# Altium schematic sheet Onion_Omega_Debug_PCB.SchDoc
size B
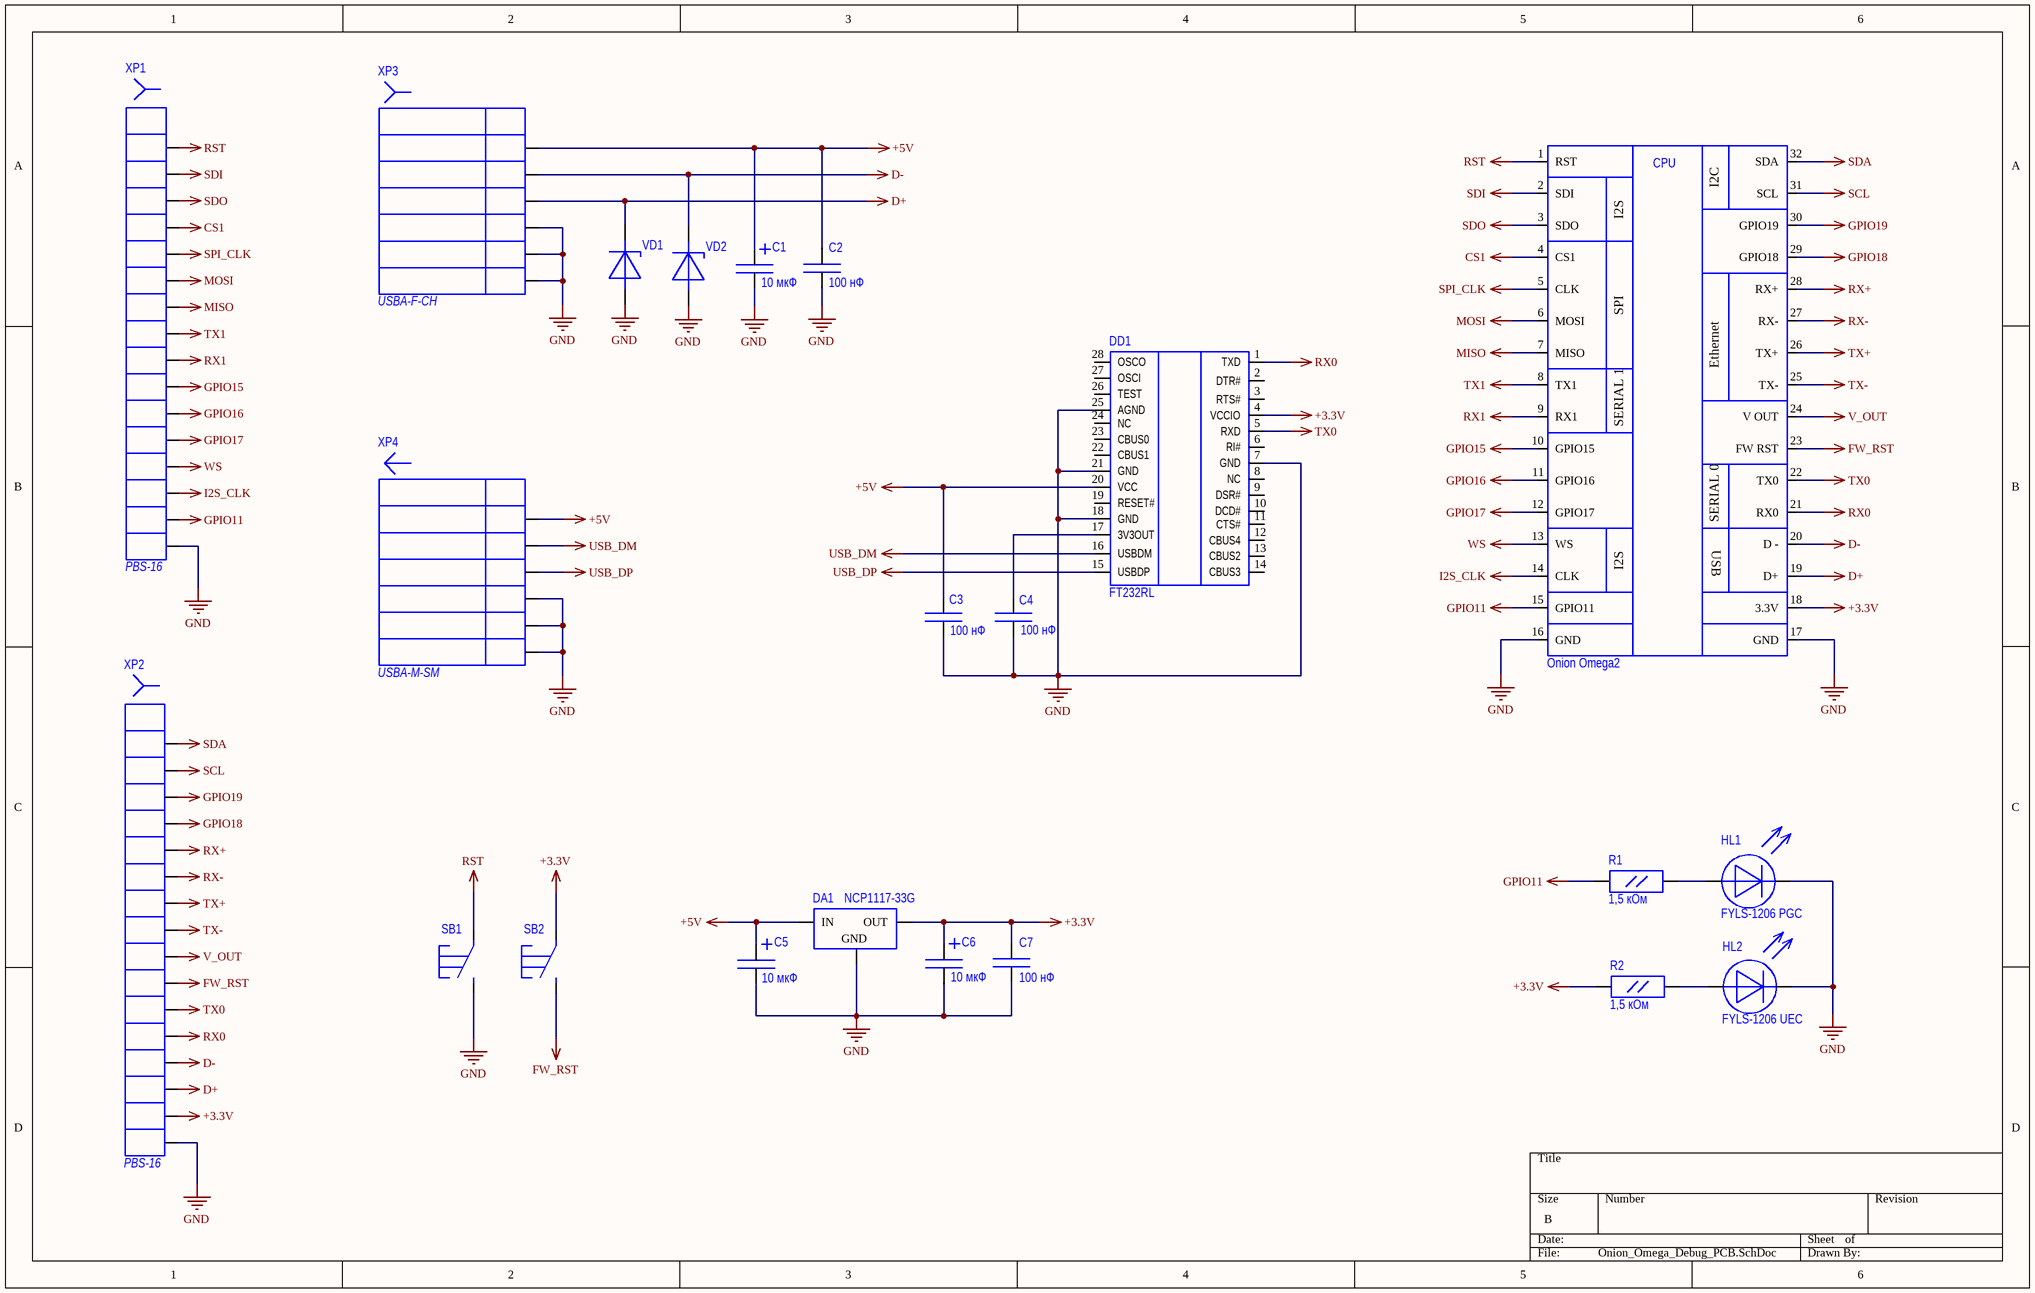
[diagram p0: Onion_Omega_Debug_PCB.SchDoc]

## Parts
C1  10 мкФ  [A-case]
C2  100 нФ  [CAP0805]
C3  100 нФ  [CAP0805]
C4  100 нФ  [CAP0805]
C5  10 мкФ  [A-case]
C6  10 мкФ  [A-case]
C7  100 нФ  [CAP0805]
DA1  NCP1117-33G  [D-PAK]
DD1  FT232RL  [SSOP-28]
HL1  FYLS-1206 PGC  [LED 1206 GREEN]
HL2  FYLS-1206 UЕC  [LED 1206 RED]
OMEGA2  Onion Omega2  [Onion_Omega2]
R1  1,5 кОм  [RES0805]
R2  1,5 кОм  [RES0805]
SB1  (no value)  [KLS7-TS6606]
SB2  (no value)  [KLS7-TS6606]
VD1  (no value)  [SOT-23]
VD2  (no value)  [SOT-23]
XP1  PBS-16  [PBS-16]
XP2  PBS-16  [PBS-16]
XP3  USBA-F-CH  [USBA-F-CH]
XP4  USBA-M-SM  [USBA-M-SM]

## Nets
+3.3V: C6.1 C7.1 DA1.2(OUT) DD1.4(VCCIO) OMEGA2.18(3.3V) R2.2 SB2.1 XP2.15
+5V: C1.1 C2.1 C3.1 C5.1 DA1.3(IN) DD1.20(VCC) XP3.1 XP4.1
CS1: OMEGA2.4(CS1) XP1.4
D+: OMEGA2.19(D+) VD1.3(C) XP2.14 XP3.3
D-: OMEGA2.20(D_-) VD2.3(C) XP2.13 XP3.2
FW_RST: OMEGA2.23(FW_RST) SB2.2 XP2.10
GND: C1.2 C2.2 C3.2 C4.1 C5.2 C6.2 C7.2 DA1.1(GND) DD1.7(GND) DD1.18(GND) DD1.21(GND) DD1.25(AGND) HL1.2(C) HL2.2(C) OMEGA2.16(GND) OMEGA2.17(GND) SB1.2 VD1.1(A) VD2.1(A) XP1.16 XP2.16 XP3.4 XP3.5 XP3.6 XP4.4 XP4.5 XP4.6
GPIO11: OMEGA2.15(GPIO11) R1.1 XP1.15
GPIO15: OMEGA2.10(GPIO15) XP1.10
GPIO16: OMEGA2.11(GPIO16) XP1.11
GPIO17: OMEGA2.12(GPIO17) XP1.12
GPIO18: OMEGA2.29(GPIO18) XP2.4
GPIO19: OMEGA2.30(GPIO19) XP2.3
I2S_CLK: OMEGA2.14(CLK) XP1.14
MISO: OMEGA2.7(MISO) XP1.7
MOSI: OMEGA2.6(MOSI) XP1.6
RST: OMEGA2.1(RST) SB1.1 XP1.1
RX0: DD1.1(TXD) OMEGA2.21(RX0) XP2.12
RX1: OMEGA2.9(RX1) XP1.9
RX+: OMEGA2.28(RX+) XP2.5
RX-: OMEGA2.27(RX-) XP2.6
SCL: OMEGA2.31(SCL) XP2.2
SDA: OMEGA2.32(SDA) XP2.1
SDI: OMEGA2.2(SDI) XP1.2
SDO: OMEGA2.3(SDO) XP1.3
SPI_CLK: OMEGA2.5(CLK) XP1.5
TX0: DD1.5(RXD) OMEGA2.22(TX0) XP2.11
TX1: OMEGA2.8(TX1) XP1.8
TX+: OMEGA2.26(TX+) XP2.7
TX-: OMEGA2.25(TX-) XP2.8
USB_DM: DD1.16(USBDM) XP4.2
USB_DP: DD1.15(USBDP) XP4.3
V_OUT: OMEGA2.24(V_OUT) XP2.9
WS: OMEGA2.13(WS) XP1.13
NetC4_2: C4.2 DD1.17(3V3OUT)
NetHL1_1: HL1.1(A) R1.2
NetHL2_1: HL2.1(A) R2.1

Not connected (* = marked no-connect by the designer): DD1 2(DTR#) 3(RTS#) 6(RI#) 8(NC) 9(DSR#) 10(DCD#) 11(CTS#) 12(CBUS4) 13(CBUS2) 14(CBUS3) 19(RESET#) 22(CBUS1) 23(CBUS0) 24(NC) 26(TEST) 27(OSCI) 28(OSCO)

## Notes on the sheet
- (in symbol D3) CPU; I2C; I2S; SPI; Ethernet; SERIAL 1; SERIAL 0; USB

## Library data of the parts
C1 C5 C6 = 871: 10 мкФ 10 В 10% тип А; ID 1C: 871; Type: конденсатор; Subtype: танталовый; Mounting method: SMD; Part number: A-case
C2-C4 C7 = 1002: 100 нФ  5% X7R; ID 1C: 1002; Type: конденсатор; Subtype: 0805; Mounting method: SMD
DA1 = D0: ID 1C: D0; Subtype: стабилизатор напряжения; Part number: NCP1117-33G; Type: микросхема
DD1 = 1752: ID 1C: 1752; Subtype: контроллер интерфейсов; Mounting method: SMD; Part number: FT232RL; Type: микросхема
HL1 = 1946: зеленый сверхяркий; ID 1C: 1946; Type: светодиод; Subtype: 1206; Mounting method: SMD; Part number: FYLS-1206 PGC
HL2 = 1053: красный; ID 1C: 1053; Type: светодиод; Subtype: 1206; Mounting method: SMD; Part number: FYLS-1206 UЕC
OMEGA2 = D3: ID 1C: D3; Part number: Onion Omega2; Type: DIY
R1 R2 = 1788: ID 1C: 1788; Subtype: 0805; Mounting method: SMD; Type: резистор
SB1 SB2 = 2117: 6x6x3.85; Part number: KLS7-TS6606-5.0; ID 1C: 2117; Mounting method: THT; Type: кнопка
VD1 VD2 = 1010: Part number: BZX84-C3V6; ID 1C: 1010; Type: стабилитрон
XP1 XP2 = D2: Part number: PBS-16 2.54mm; ID 1C: D2; Type: разъем
XP3 = D1: Part number: разъем USBA-F-CH; ID 1C: D1; Type: разъем
XP4 = 998: Part number: разъем USBA-M-SM; ID 1C: 998; Type: разъем